# EAGLE design Power_Modem_Breakout (EAGLE 6.2)
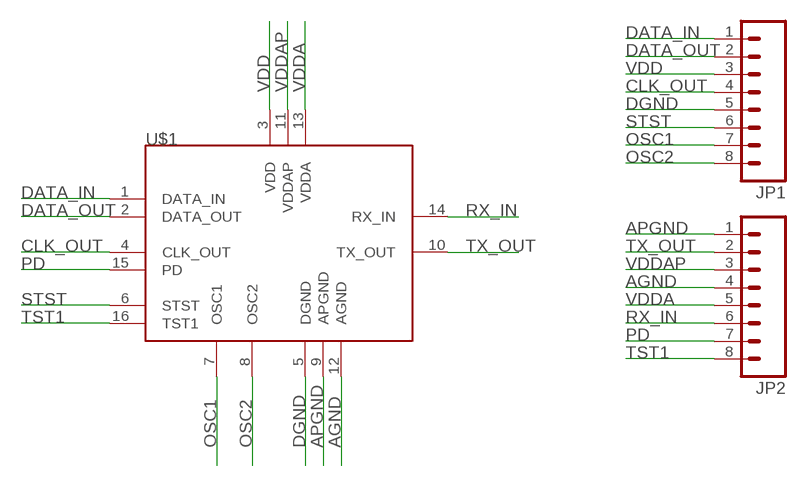
[diagram p0: schematic, sheet 1]

## Parts
JP1  M08LONGPADS  [1X08_LONGPADS]
JP2  M08LONGPADS  [1X08_LONGPADS]
U$1  TDA5052AT  [SO16L]

## Nets
AGND: JP2.4 U$1.12(AGND)
APGND: JP2.1 U$1.9(APGND)
CLK_OUT: JP1.4 U$1.4(CLK_OUT)
DATA_IN: JP1.1 U$1.1(DATA_IN)
DATA_OUT: JP1.2 U$1.2(DATA_OUT)
DGND: JP1.5 U$1.5(DGND)
OSC1: JP1.7 U$1.7(OSC1)
OSC2: JP1.8 U$1.8(OSC2)
PD: JP2.7 U$1.15(PD)
RX_IN: JP2.6 U$1.14(RX_IN)
STST: JP1.6 U$1.6(STST)
TST1: JP2.8 U$1.16(TST1)
TX_OUT: JP2.2 U$1.10(TX_OUT)
VDD: JP1.3 U$1.3(VDD)
VDDA: JP2.5 U$1.13(VDDA)
VDDAP: JP2.3 U$1.11(VDDAP)

## Library data of the parts
JP1 JP2 = SparkFun-Connectors:M08: Header 8 Standard 8-pin 0.1" header. Use with straight break away headers (SKU : PRT-00116), right angle break away headers (PRT-00553), swiss pins (PRT-00743), machine pins (PRT-00117), and female headers (PRT-00115).
U$1 = Power_Modem:TDA5052AT

## Board
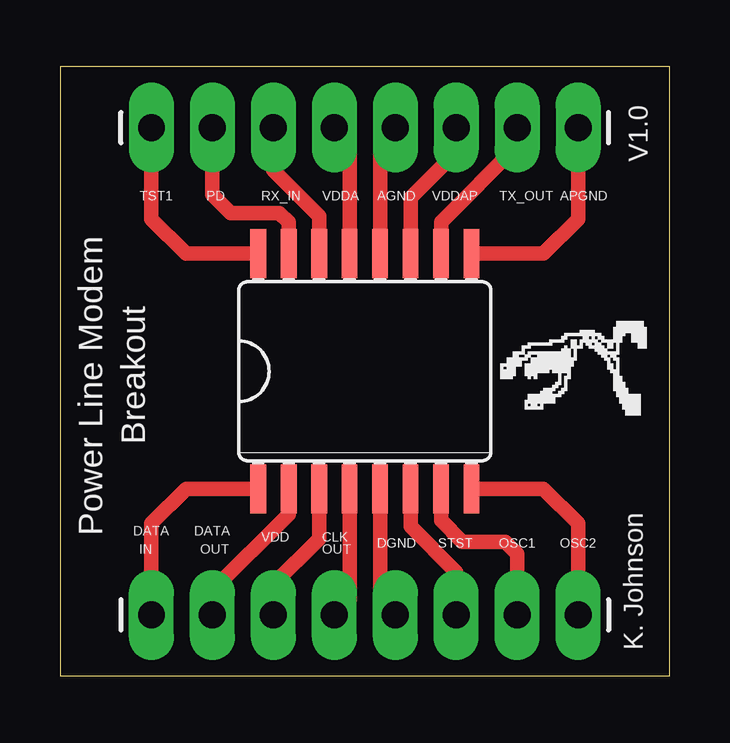
[diagram p1: board, top side]

Size 25.4 x 25.4 mm. Coordinates in mm from the lower left corner, seen from the top.
Outline: 0,0 25.4,0 25.4,25.4 0,25.4 0,0
Copper layers (1*16): Top 0.0356mm / dielectric 1.5011mm / Bottom 0.0356mm
Design rules: minimum track width 6mil, minimum drill 13mil, track to track 6mil, track to pad 6mil, pad to pad 6mil, via to via 6mil, smd to smd 6mil, copper to edge 15mil, drill to drill 6mil, minimum pad ring 7mil, minimum via ring 7mil, stop-mask expansion 3mil, vias tented up to drill 0mil, thermal gap 10mil

### Footprints (pad centres in the part's own frame; a part is rotated, then mirrored left to right if it is on the bottom)
1X08_LONGPADS = drill 1.118 pad 1.88 long: 1 0,0; 2 2.54,0; 3 5.08,0; 4 7.62,0; 5 10.16,0; 6 12.7,0; 7 15.24,0; 8 17.78,0
SO16L = smd 0.66 x 2.032: 1 -4.445,-4.902; 2 -3.175,-4.902; 3 -1.905,-4.902; 4 -0.635,-4.902; 5 0.635,-4.902; 6 1.905,-4.902; 7 3.175,-4.902; 8 4.445,-4.902; 9 4.445,4.902; 10 3.175,4.902; 11 1.905,4.902; 12 0.635,4.902; 13 -0.635,4.902; 14 -1.905,4.902; 15 -3.175,4.902; 16 -4.445,4.902

### Placement (x,y rotation side)
JP1  3.81,2.54 0 top
JP2  21.59,22.86 180 top
U$1  12.7,12.7 0 top

### Tracks (layer width: path | path; a pad name or v marks a point on that pad's centre or on a via)
AGND
  Top 0.61: U$1.12 13.34,22.23 JP2.4
APGND
  Top 0.61: U$1.9 20.14,17.6 21.59,19.05 JP2.1
CLK_OUT
  Top 0.61: U$1.4 12.06,3.17 JP1.4
DATA_IN
  Top 0.61: U$1.1 5.26,7.8 3.81,6.35 JP1.1
DATA_OUT
  Top 0.61: U$1.2 9.53,6.73 6.35,3.56 JP1.2
DGND
  Top 0.61: U$1.5 13.34,3.17 JP1.5
OSC1
  Top 0.61: U$1.7 15.88,6.48 16.76,5.59 18.54,5.59 19.05,5.08 JP1.7
OSC2
  Top 0.61: U$1.8 20.14,7.8 21.59,6.35 JP1.8
PD
  Top 0.61: U$1.15 9.53,18.92 9.14,19.3 7.11,19.3 6.35,20.07 JP2.7
RX_IN
  Top 0.61: U$1.14 10.79,19.18 8.89,21.08 JP2.6
STST
  Top 0.61: U$1.6 14.61,6.22 16.51,4.32 JP1.6
TST1
  Top 0.61: U$1.16 5.26,17.6 3.81,19.05 JP2.8
TX_OUT
  Top 0.61: U$1.10 15.88,18.92 19.05,22.1 JP2.2
VDD
  Top 0.61: U$1.3 10.79,5.71 8.89,3.81 JP1.3
VDDA
  Top 0.61: U$1.13 12.06,22.23 JP2.5
VDDAP
  Top 0.61: U$1.11 14.61,19.94 16.51,21.84 JP2.3

### Text on the board
tPlace: V1.0 | TST1 | PD | RX_IN | VDDA | AGND | VDDAP | TX_OUT | APGND | Breakout | Power Line Modem | DATA | DATA | VDD | CLK | IN | OUT | OUT | DGND | STST | OSC1 | OSC2 | K. Johnson